# EAGLE design mcu_hw_board (EAGLE 5.11)
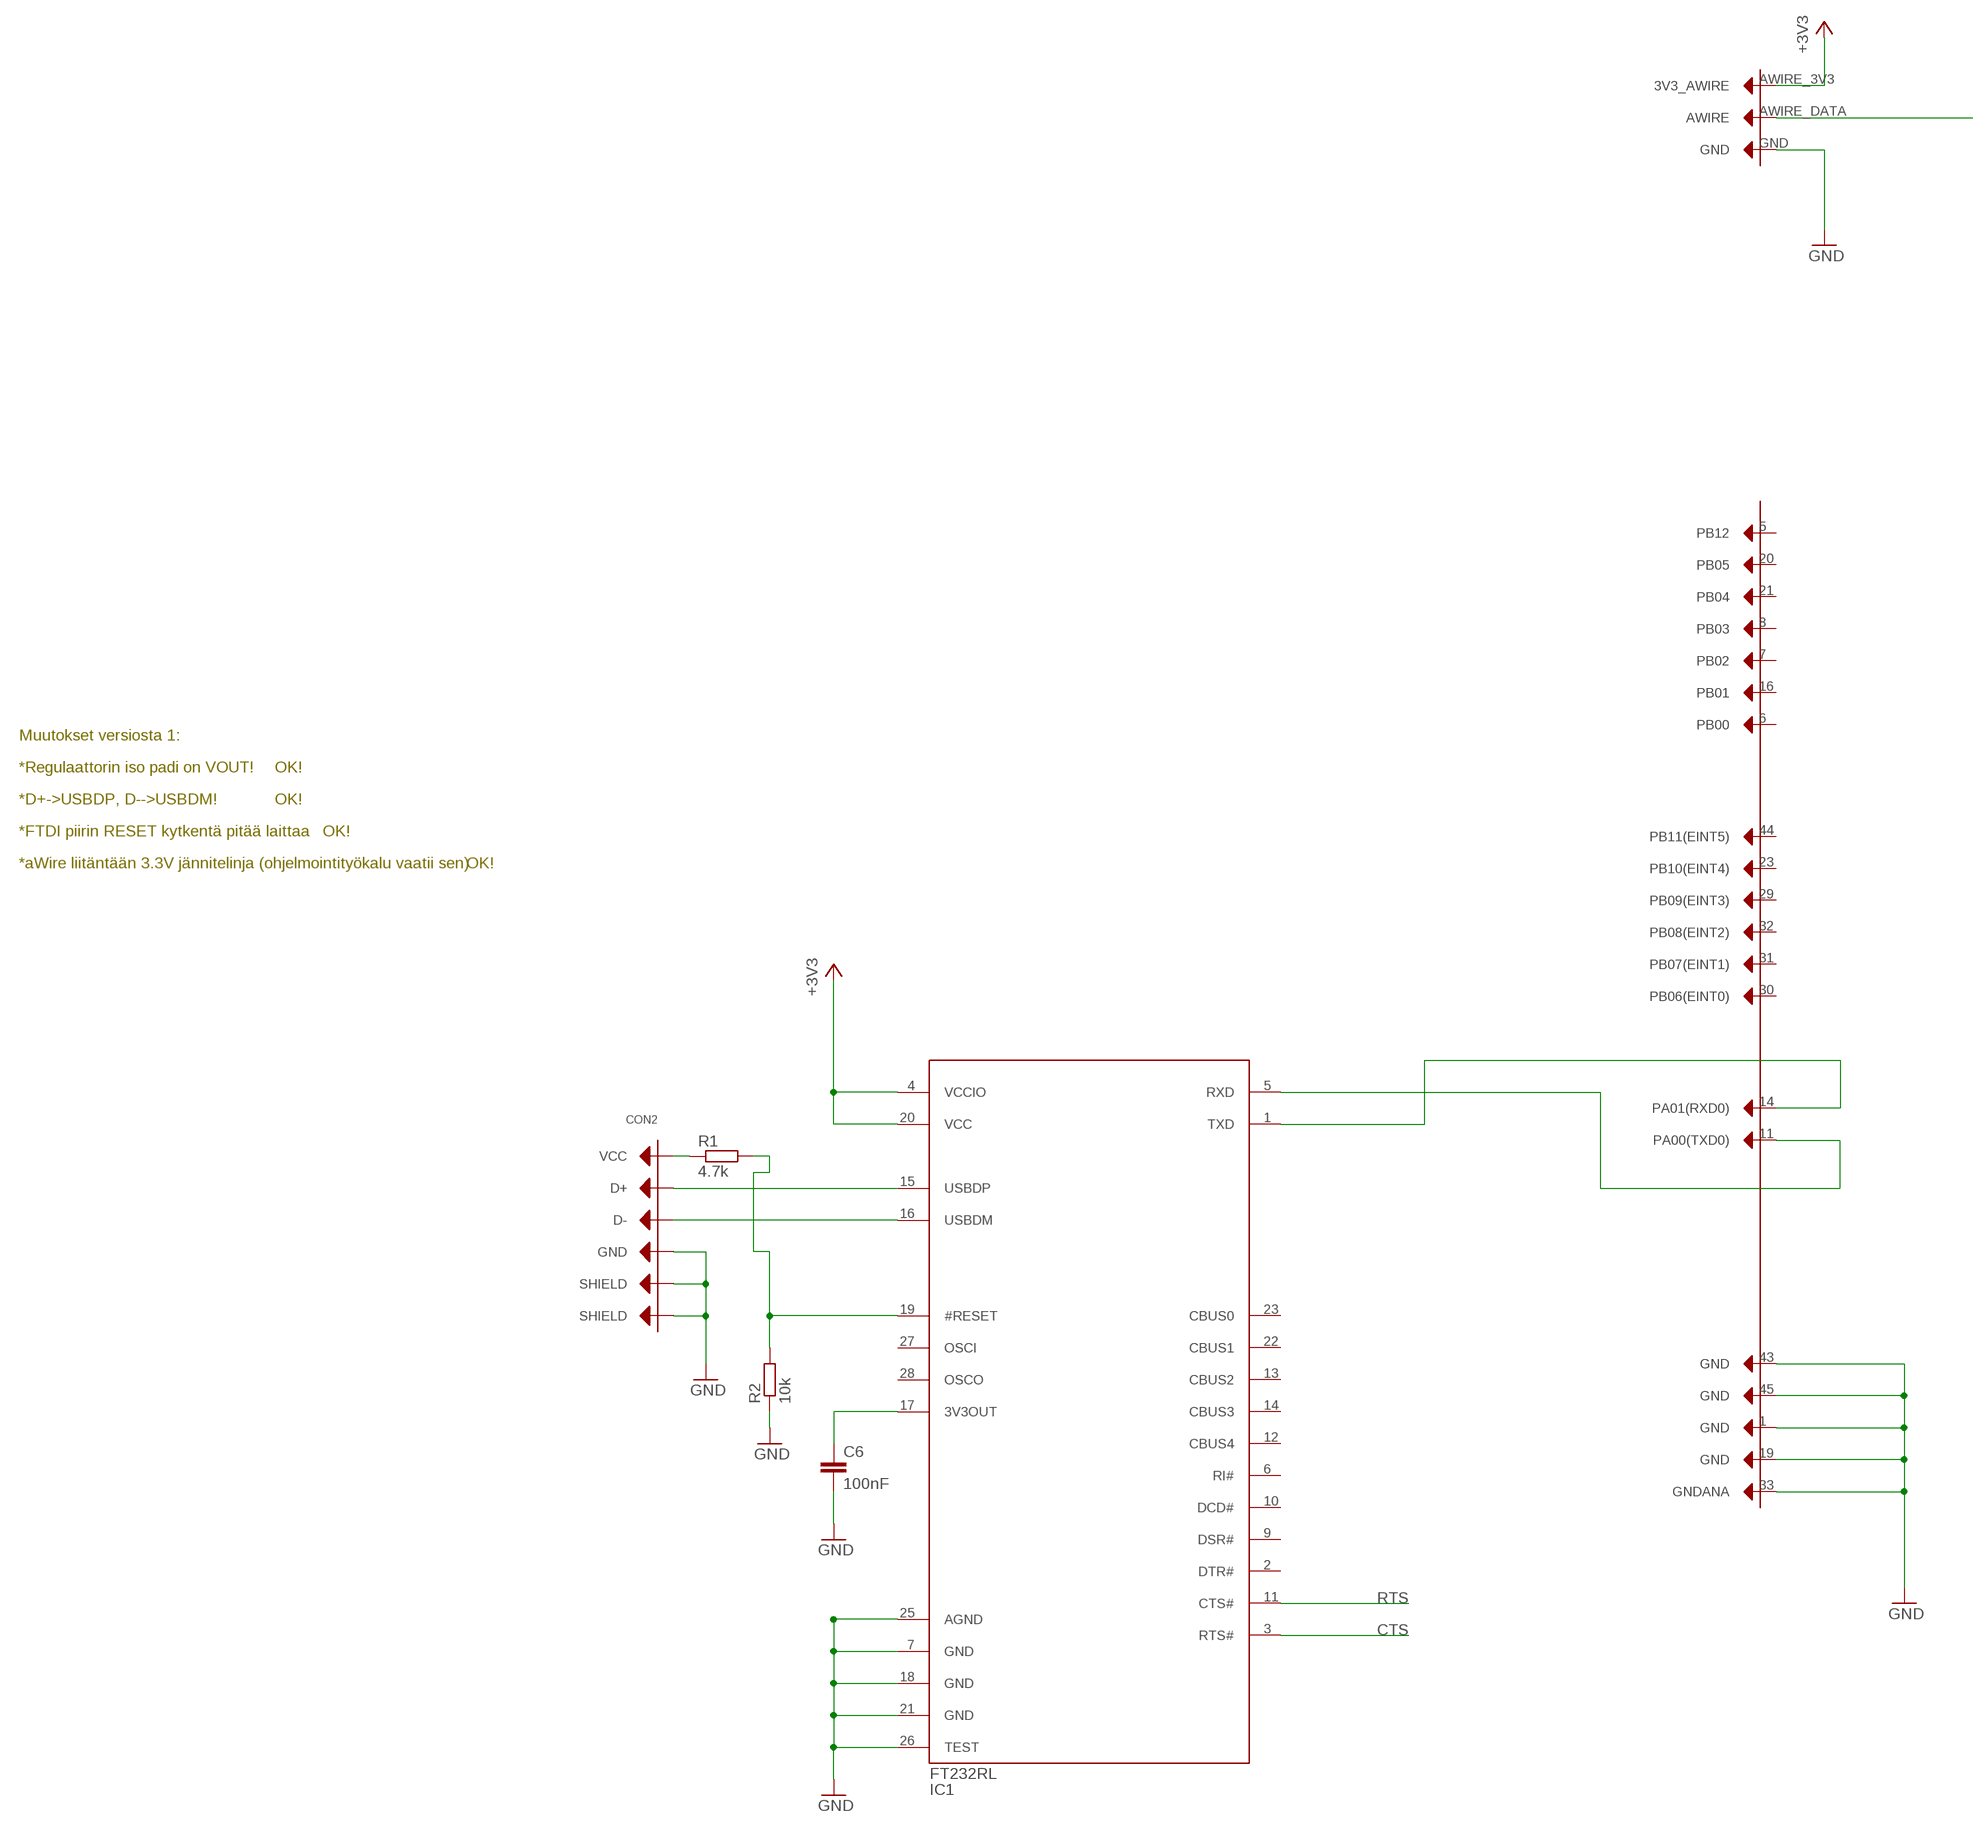
[diagram p0: schematic, sheet 1, part 1 of 2]
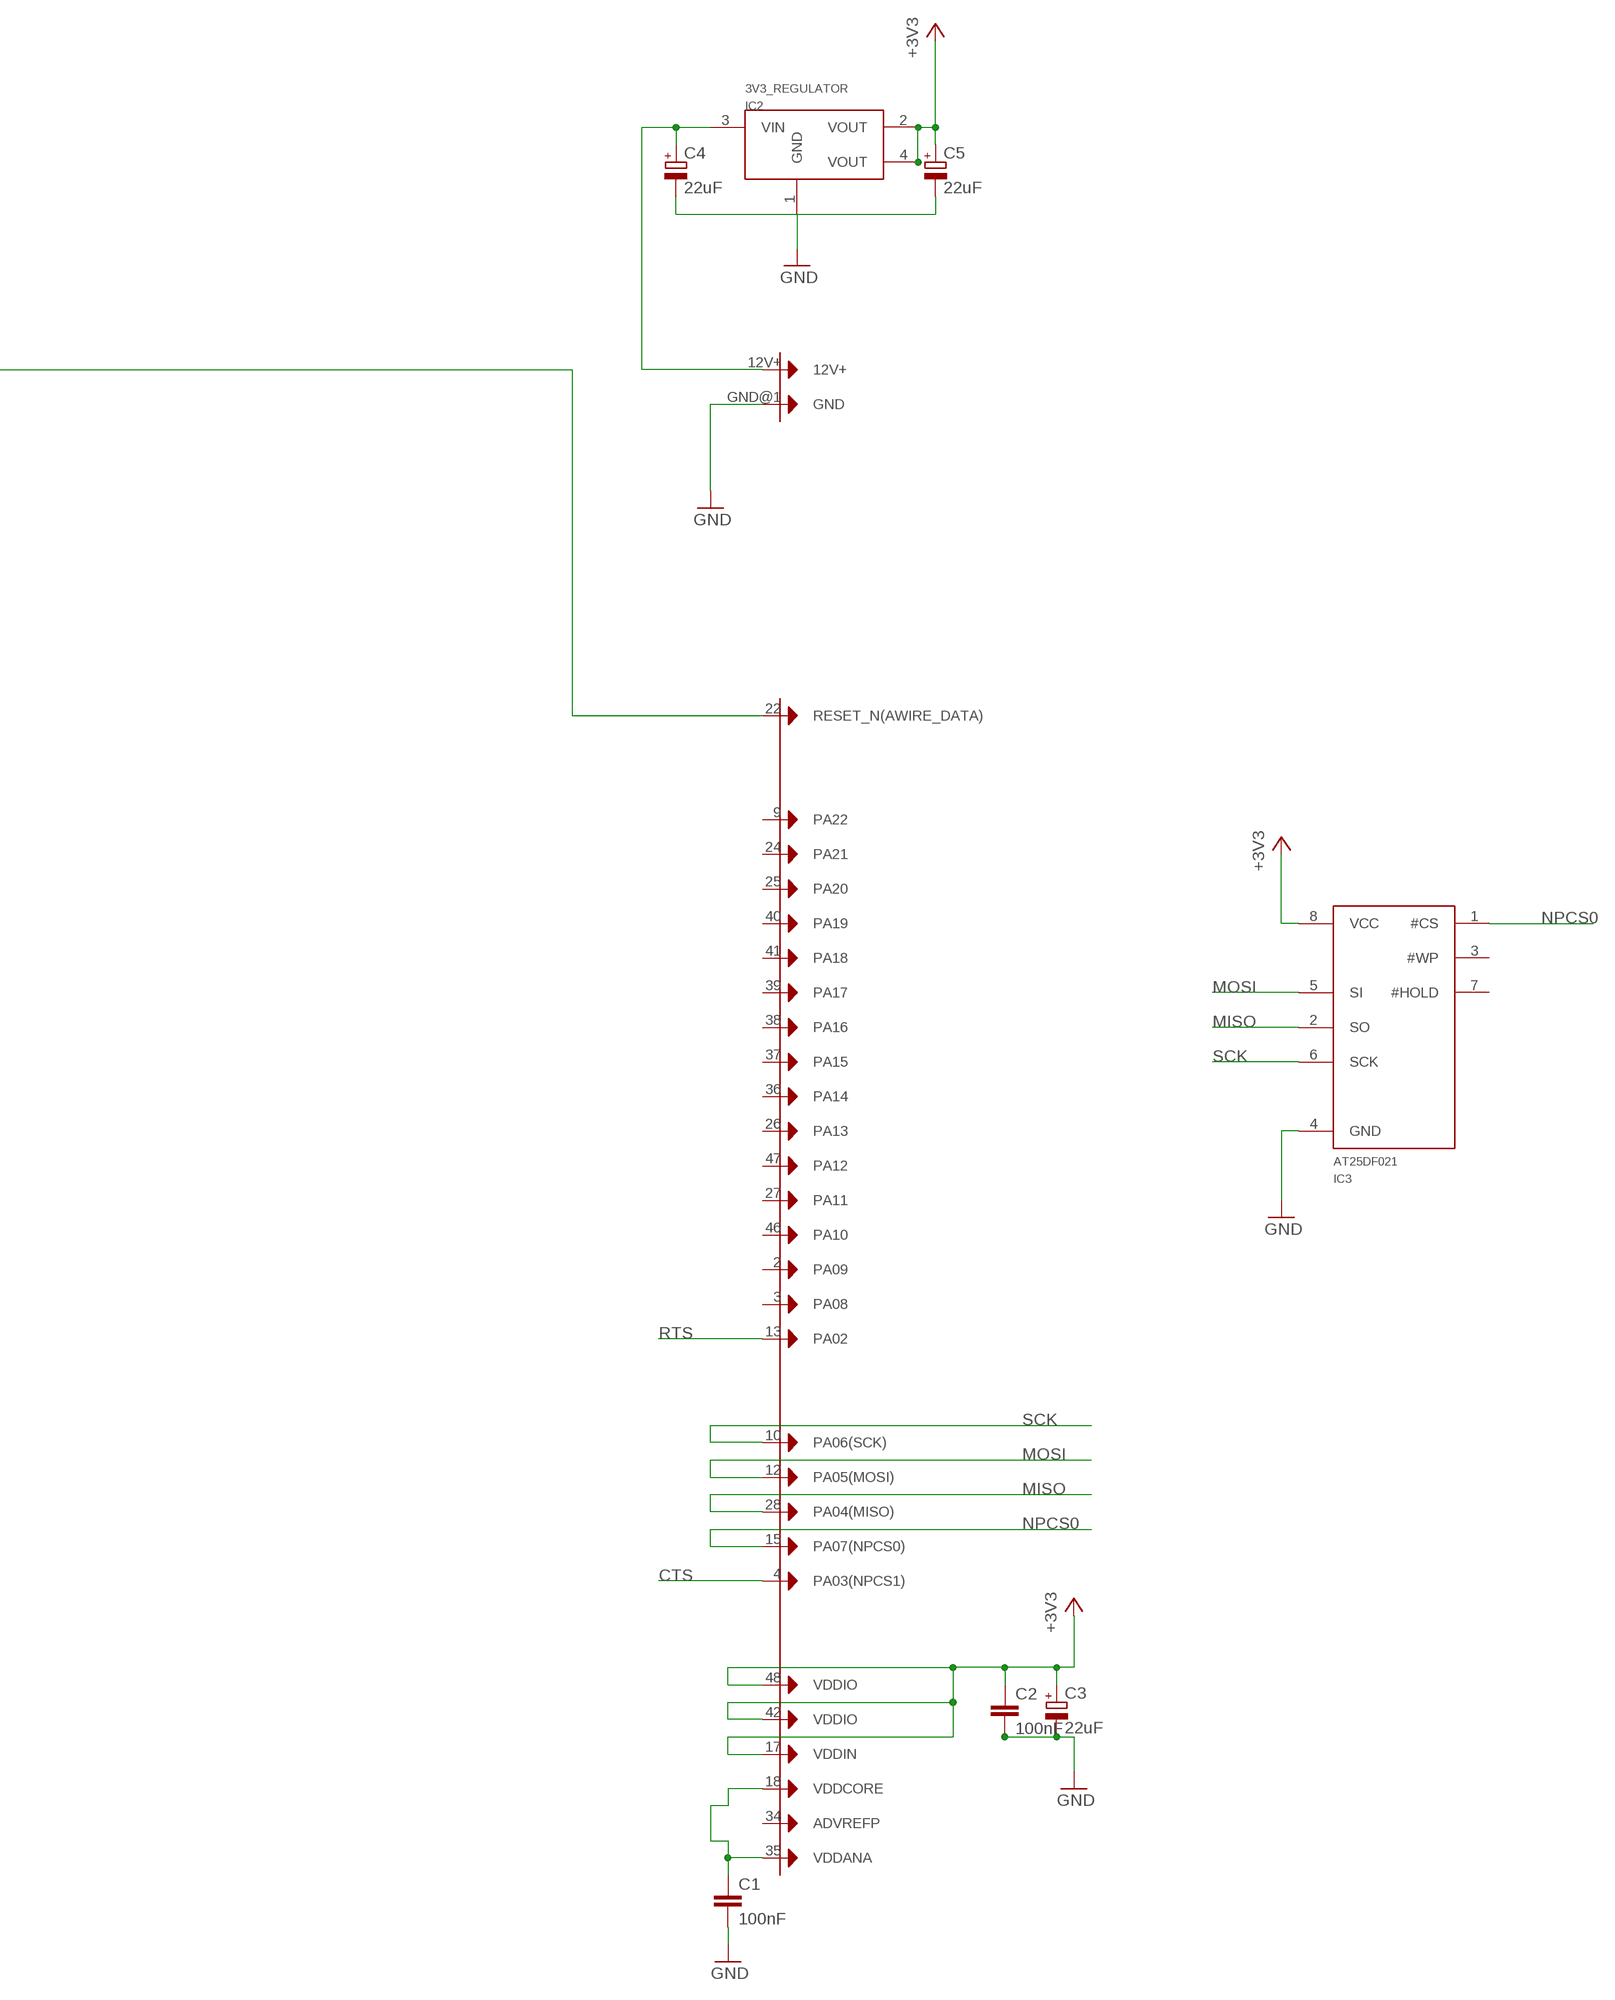
[diagram p1: schematic, sheet 1, part 2 of 2]

## Parts
C1  100nF  C-EU025-025X050  [C025-025X050]
C2  100nF  C-EU025-025X050  [C025-025X050]
C3  22uF  CPOL-EUE2-4  [E2-4]
C4  22uF  CPOL-EUE2-5  [E2-5]
C5  22uF  CPOL-EUE2-5  [E2-5]
C6  100nF  C-EU025-025X050  [C025-025X050]
CON1  IO_BOARD_CONNECTOR  IO_BOARD_CONNECTORUUSI  [AT32UCL_IO_BOARD_CONNECTOR_V2]
CON2  USB-B  [USB-B-THROUGH-HOLE]
IC1  FT232RL  [SSOP28]
IC2  3V3REGULATOR  [SOT223]
IC3  FLASH_AT25DF021  [SO8]
R1  4.7k  R-EU_0207/10  [0207/10]
R2  10k  R-EU_0207/10  [0207/10]

## Nets
+3V3: C2.1 C3.+ C5.+ CON1.17(VDDIN) CON1.42(VDDIO) CON1.48(VDDIO) CON1.AWIRE_3V3(3V3_AWIRE) IC1.4(VCCIO) IC1.20(VCC) IC2.2(VOUT) IC2.4(VOUT) IC3.8(VCC)
CTS: CON1.4(PA03(NPCS1)) IC1.3(RTS#)
GND: C1.2 C2.2 C3.- C4.- C5.- C6.2 CON1.1(GND) CON1.19(GND) CON1.33(GNDANA) CON1.43(GND) CON1.45(GND) CON1.GND CON1.GND@1(GND) CON2.GND CON2.SHIELD CON2.SHIELD@2(SHIELD) IC1.7(GND) IC1.18(GND) IC1.21(GND) IC1.25(AGND) IC1.26(TEST) IC2.1(GND) IC3.4(GND) R2.1
MISO: CON1.28(PA04(MISO)) IC3.2(SO)
MOSI: CON1.12(PA05(MOSI)) IC3.5(SI)
N$14: CON1.14(PA01(RXD0)) IC1.1(TXD)
N$15: CON1.11(PA00(TXD0)) IC1.5(RXD)
N$16: CON1.22(RESET_N(AWIRE_DATA)) CON1.AWIRE_DATA(AWIRE)
N$33: CON2.D+ IC1.15(USBDP)
N$34: CON2.D- IC1.16(USBDM)
N$36: IC1.19(#RESET) R1.2 R2.2
N$38: C4.+ CON1.12V+ IC2.3(VIN)
N$39: CON2.VCC R1.1
N$43: C6.1 IC1.17(3V3OUT)
N$46: C1.1 CON1.18(VDDCORE) CON1.35(VDDANA)
NPCS0: CON1.15(PA07(NPCS0)) IC3.1(#CS)
RTS: CON1.13(PA02) IC1.11(CTS#)
SCK: CON1.10(PA06(SCK)) IC3.6(SCK)
Unconnected: CON1.2(PA09) CON1.3(PA08) CON1.5(PB12) CON1.6(PB00) CON1.7(PB02) CON1.8(PB03) CON1.9(PA22) CON1.16(PB01) CON1.20(PB05) CON1.21(PB04) CON1.23(PB10(EINT4)) CON1.24(PA21) CON1.25(PA20) CON1.26(PA13) CON1.27(PA11) CON1.29(PB09(EINT3)) CON1.30(PB06(EINT0)) CON1.31(PB07(EINT1)) CON1.32(PB08(EINT2)) CON1.34(ADVREFP) CON1.36(PA14) CON1.37(PA15) CON1.38(PA16) CON1.39(PA17) CON1.40(PA19) CON1.41(PA18) CON1.44(PB11(EINT5)) CON1.46(PA10) CON1.47(PA12) IC1.2(DTR#) IC1.6(RI#) IC1.9(DSR#) IC1.10(DCD#) IC1.12(CBUS4) IC1.13(CBUS2) IC1.14(CBUS3) IC1.22(CBUS1) IC1.23(CBUS0) IC1.27(OSCI) IC1.28(OSCO) IC3.3(#WP) IC3.7(#HOLD)

## Notes on the sheet
- Muutokset versiosta 1:
- *Regulaattorin iso padi on VOUT! | OK!
- *D+->USBDP, D-->USBDM! | OK!
- *FTDI piirin RESET kytkentä pitää laittaa | OK!
- *aWire liitäntään 3.3V jännitelinja (ohjelmointityökalu vaatii sen) | OK!

## Library data of the parts
C1 C2 C6 = RC_and_L:C-EU: CAPACITOR, European symbol
C3-C5 = RC_and_L:CPOL-EU: POLARIZED CAPACITOR, European symbol
CON1 = osat:IO_BOARD_CONNECTOR
CON2 = osat:USB-B
IC1 = osat:FT232RL
IC2 = osat:3V3REGULATOR
IC3 = osat:FLASH_AT25DF021
R1 R2 = RC_and_L:R-EU_: RESISTOR, European symbol

## Board
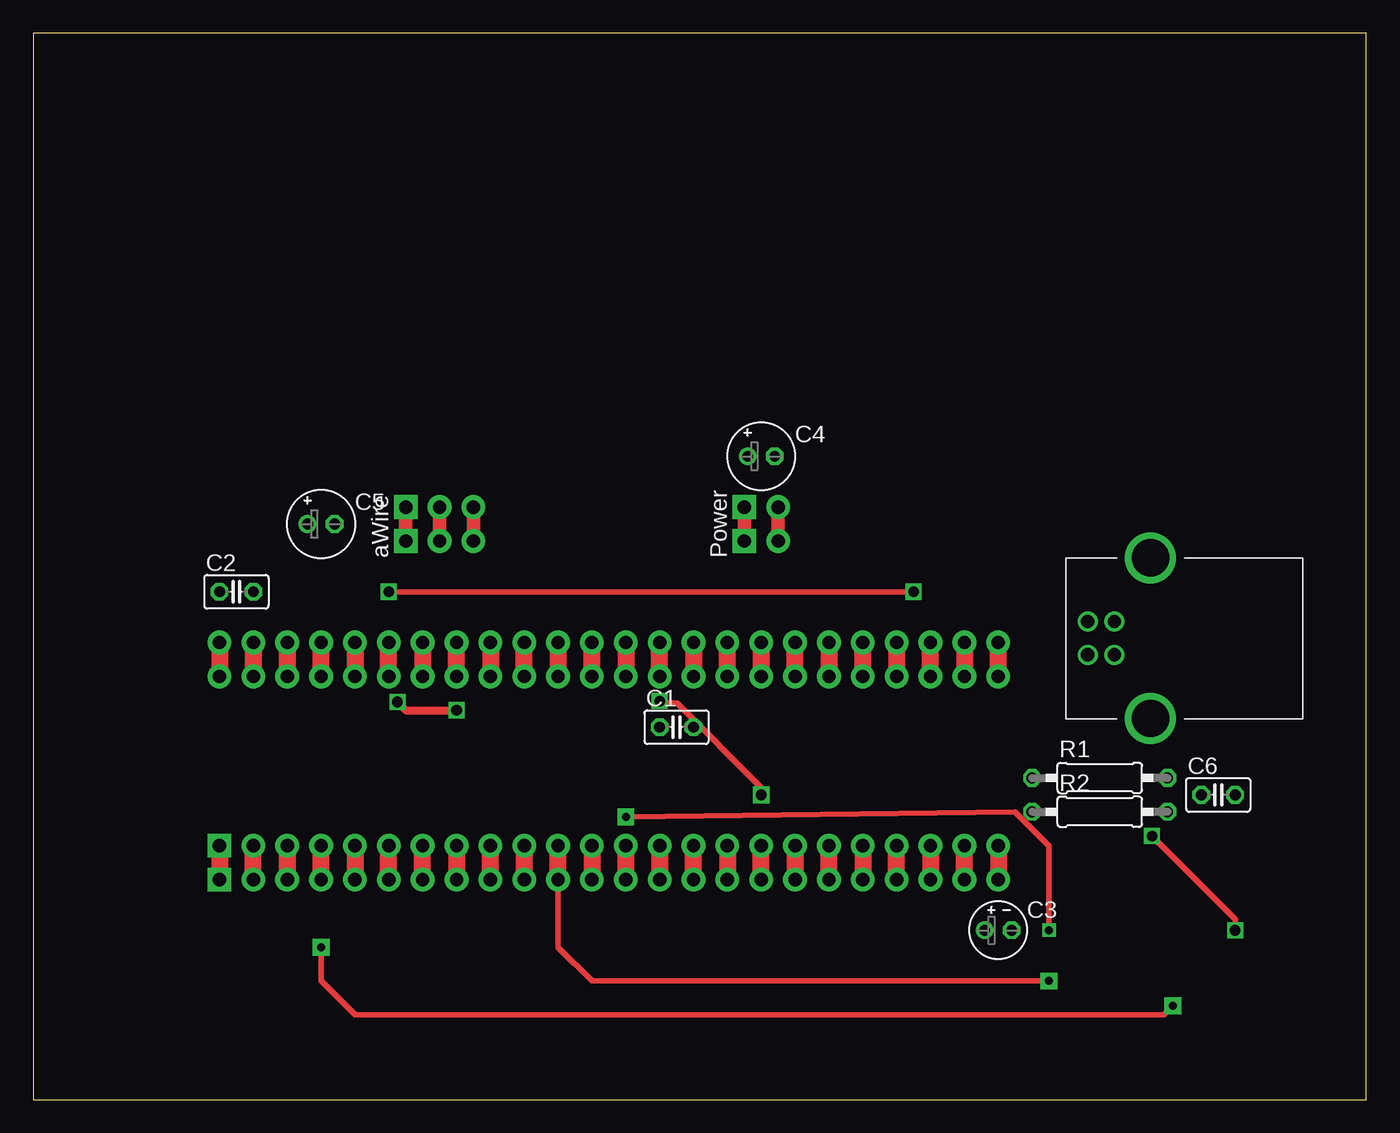
[diagram p2: board, top side]
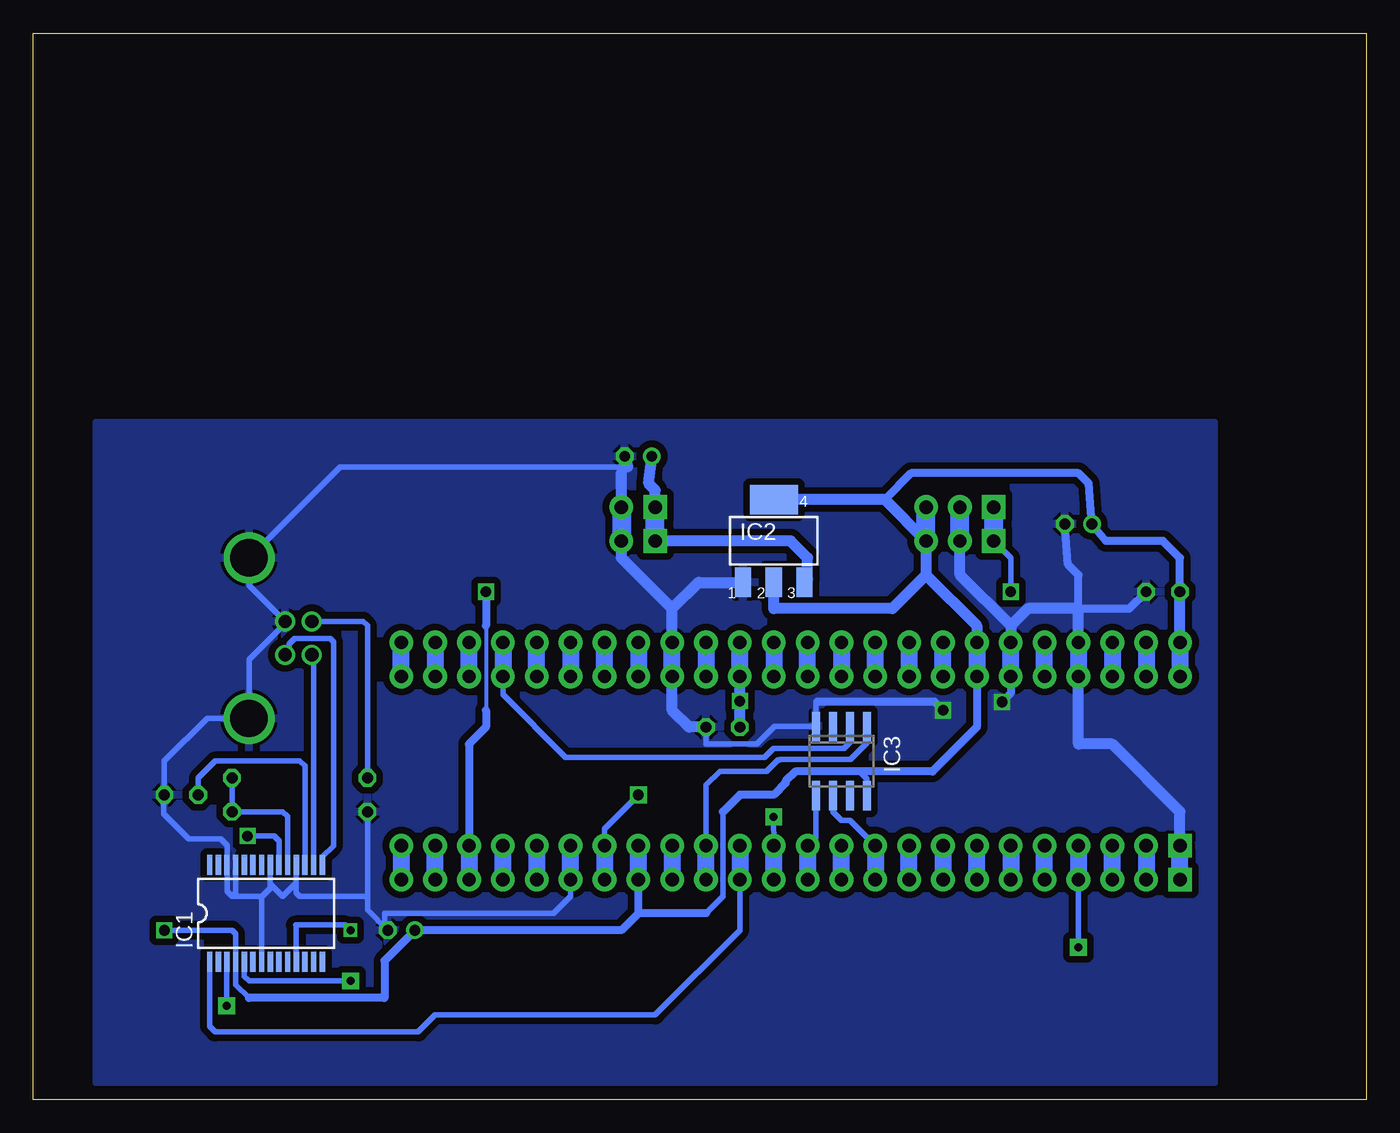
[diagram p3: board, bottom side, seen from below]

Size 100 x 80 mm. Coordinates in mm from the lower left corner, seen from the top.
Outline: 0,0 100,0 100,80 0,80 0,0
Copper layers (1*16): Top 0.035mm / dielectric 1.5mm / Bottom 0.035mm
Design rules "prototyping_home": minimum track width 0.4mm, minimum drill 24mil, track to track 20mil, track to pad 20mil, pad to pad 8mil, via to via 8mil, smd to smd 8mil, copper to edge 40mil, drill to drill 8mil, minimum pad ring 10mil, minimum via ring 8mil, stop-mask expansion 4mil, vias tented up to drill 0mil, thermal gap 10mil

### Footprints (pad centres in the part's own frame; a part is rotated, then mirrored left to right if it is on the bottom)
C025-025X050 = drill 0.813 octagon: 1 -1.27,0; 2 1.27,0
E2-4 = drill 0.813 pad 1.27 round: + -1.016,0 | drill 0.813 pad 1.27 octagon: - 1.016,0
E2-5 = drill 0.813 pad 1.27 round: + -1.016,0 | drill 0.813 pad 1.27 octagon: - 1.016,0
AT32UCL_IO_BOARD_CONNECTOR_V2 = drill 1 pad 1.778 square: 1 -15.24,-19.05; 12V+ 24.13,3.81; AWIRE_DATA -1.27,3.81; NC1 -15.24,-21.59; P$100 -1.27,6.35; P$104 24.13,6.35 | drill 1 pad 1.778 round: 2 -12.7,-19.05; 3 -10.16,-19.05; 4 -7.62,-19.05; 5 -5.08,-19.05; 6 -2.54,-19.05; 7 0,-19.05; 8 2.54,-19.05; 9 5.08,-19.05; 10 7.62,-19.05; 11 10.16,-19.05; 12 12.7,-19.05; 13 15.24,-19.05; 14 17.78,-19.05; 15 20.32,-19.05; 16 22.86,-19.05; 17 25.4,-19.05; 18 27.94,-19.05; 19 30.48,-19.05; 20 33.02,-19.05; 21 35.56,-19.05; 22 38.1,-19.05; 23 40.64,-19.05; 24 43.18,-19.05; 25 43.18,-3.81; 26 40.64,-3.81; 27 38.1,-3.81; 28 35.56,-3.81; 29 33.02,-3.81; 30 30.48,-3.81; 31 27.94,-3.81; 32 25.4,-3.81; 33 22.86,-3.81; 34 20.32,-3.81; 35 17.78,-3.81; 36 15.24,-3.81; 37 12.7,-3.81; 38 10.16,-3.81; 39 7.62,-3.81; 40 5.08,-3.81; 41 2.54,-3.81; 42 0,-3.81; 43 -2.54,-3.81; 44 -5.08,-3.81; 45 -7.62,-3.81; 46 -10.16,-3.81; 47 -12.7,-3.81; 48 -15.24,-3.81; 49 43.18,-6.35; 50 40.64,-6.35; 51 38.1,-6.35; 52 35.56,-6.35; 53 33.02,-6.35; 54 30.48,-6.35; 55 27.94,-6.35; 56 25.4,-6.35; 57 22.86,-6.35; 58 20.32,-6.35; 59 17.78,-6.35; 60 15.24,-6.35; 61 12.7,-6.35; 62 10.16,-6.35; 63 7.62,-6.35; 64 5.08,-6.35; 65 2.54,-6.35; 66 0,-6.35; 67 -2.54,-6.35; 68 -5.08,-6.35; 69 -7.62,-6.35; 70 -10.16,-6.35; 71 -12.7,-6.35; 72 -15.24,-6.35; AWIRE_3V3 3.81,3.81; GND 1.27,3.81; GND@1 26.67,3.81; NC2 -12.7,-21.59; NC3 -10.16,-21.59; NC4 -7.62,-21.59; NC5 -5.08,-21.59; NC6 -2.54,-21.59; NC7 0,-21.59; NC8 2.54,-21.59; NC9 5.08,-21.59; NC10 7.62,-21.59; NC11 10.16,-21.59; NC12 12.7,-21.59; NC13 15.24,-21.59; NC14 17.78,-21.59; NC15 20.32,-21.59; NC16 22.86,-21.59; NC17 25.4,-21.59; NC18 27.94,-21.59; NC19 30.48,-21.59; NC20 33.02,-21.59; NC21 35.56,-21.59; NC22 38.1,-21.59; NC23 40.64,-21.59; NC24 43.18,-21.59; P$1 3.81,6.35; P$99 1.27,6.35; P$103 26.67,6.35
USB-B-THROUGH-HOLE = drill 1 round: D+ 7.27,-2.71; D- 7.27,-4.71; GND 4.77,-2.71; VCC 4.77,-4.71 | drill 2.8 round: SHIELD 0,0; SHIELD@2 12.04,0
SSOP28 = smd 0.4 x 1.5: 1 -4.225,-3.625; 2 -3.575,-3.625; 3 -2.925,-3.625; 4 -2.275,-3.625; 5 -1.625,-3.625; 6 -0.975,-3.625; 7 -0.325,-3.625; 8 0.325,-3.625; 9 0.975,-3.625; 10 1.625,-3.625; 11 2.275,-3.625; 12 2.925,-3.625; 13 3.575,-3.625; 14 4.225,-3.625; 15 4.225,3.625; 16 3.575,3.625; 17 2.925,3.625; 18 2.275,3.625; 19 1.625,3.625; 20 0.975,3.625; 21 0.325,3.625; 22 -0.325,3.625; 23 -0.975,3.625; 24 -1.625,3.625; 25 -2.275,3.625; 26 -2.925,3.625; 27 -3.575,3.625; 28 -4.225,3.625
SOT223 = smd 1.219 x 2.235: 1 -2.311,-3.099; 2 0,-3.099; 3 2.311,-3.099 | smd 3.6 x 2.2: 4 0,3.099
SO8 = smd 0.6 x 2.2: 1 -1.905,-2.6; 2 -0.635,-2.6; 3 0.635,-2.6; 4 1.905,-2.6; 5 1.905,2.6; 6 0.635,2.6; 7 -0.635,2.6; 8 -1.905,2.6
0207/10 = drill 0.813 octagon: 1 -5.08,0; 2 5.08,0

### Placement (x,y rotation side)
C1  48.26,27.94 0 top
C2  15.24,38.1 0 top
C3  72.39,12.7 0 top
C4  54.61,48.26 0 top
C5  21.59,43.18 0 top
C6  88.9,22.86 0 top
CON1  29.21,38.1 0 top
CON2  83.82,40.64 270 top
IC1  82.55,13.97 0 bottom
IC2  44.45,41.91 0 bottom
IC3  39.37,25.4 180 bottom
R1  80.01,24.13 0 top
R2  80.01,21.59 0 top

### Tracks (layer width: path | path; a pad name or v marks a point on that pad's centre or on a via)
+3V3  (via drill 0.8)
  Top 0.406: v90.17,12.7 90.17,13.53 v83.93,19.77
  Bottom 0.406: IC3.8 37.47,24.07 38.01,24.61 42.84,24.61 | 43.56,23.89 43.56,23.75 | 48.26,21.59 48.26,15.24 49.53,13.97 | v90.17,12.7 85.09,12.7 84.83,12.44 IC1.4 84.83,8.62 83.82,7.62 | IC1.20 81.58,19.4 81.95,19.77 v83.93,19.77
  Bottom 0.61: 43.56,23.89 42.84,24.61 32.54,24.61 29.21,27.94 CON1.42 | 43.56,23.75 44.45,22.86 46.99,22.86 48.26,21.59 | 49.53,13.97 54.61,13.97 | 54.61,13.97 CON1.17 | 54.61,13.97 55.88,12.7 C3.+ 73.66,10.41 73.66,7.62 83.82,7.62 | 36.12,45.01 34.14,46.99 21.59,46.99 20.82,46.22 C5.+ 19.55,41.91 15.24,41.91 13.97,40.64 C2.1
  Bottom 0.813: 33.02,39.37 CON1.AWIRE_3V3 36.12,45.01 IC2.4 | CON1.42 29.21,35.56 33.02,39.37 | IC2.2 44.45,36.83 35.56,36.83 33.02,39.37 | CON1.48 C2.1
CTS  (via drill 0.6 pad 1.27)
  Top 0.406: v21.59,11.43 21.59,8.89 24.13,6.35 84.81,6.35 v85.49,7.03
  Bottom 0.406: v21.59,11.43 CON1.4 | v85.49,7.03 85.49,10.33 IC1.3
GND  (via drill 0.8)
  Top 0.61: v31.75,29.21 27.94,29.21 v27.32,29.83
  Bottom 0.406: C1.2 49.53,26.67 45.72,26.67 44.39,28 IC3.4 41.27,29.73 41.18,29.83 | 82.88,15.2 IC1.7 | 82.88,15.2 82.22,15.85 IC1.21 82.22,16.18 81.28,15.24 80.28,16.25 IC1.18 80.28,15.51 80.01,15.24 74.93,15.24 | 85.09,15.24 85.47,15.62 IC1.26 85.47,19.09 85.94,19.56 88.35,19.56 90.22,21.43 90.22,22.81 C6.2 90.17,25.4 86.97,28.6 CON2.SHIELD@2 83.82,33.02 81.11,35.73 CON2.GND 83.82,38.58 CON2.SHIELD 76.99,47.47 55.4,47.47 | 85.09,15.24 82.92,15.24 82.88,15.2 | IC1.25 84.83,15.51 85.09,15.24 | 74.93,15.24 R2.1 | 74.93,15.24 74.93,14.22 C3.- 73.66,12.95 73.66,13.97 60.96,13.97 59.69,15.24 CON1.19 | 55.88,46.99 55.88,47.78 C4.-
  Bottom 0.61: C2.2 17.78,36.83 21.59,36.83 21.59,39.37 22.38,40.16 C5.- | CON1.43 26.67,30.48 v27.32,29.83 | 41.18,29.83 32.37,29.83 v31.75,29.21
  Bottom 0.813: 26.67,35.56 30.48,39.37 CON1.GND | IC2.1 50.09,38.81 52.07,36.83 | 52.07,36.83 CON1.33 52.07,29.21 50.8,27.94 C1.2 | 52.07,36.83 55.88,40.64 CON1.GND@1 55.88,46.99 | C4.- 55.4,47.47 | 26.67,35.56 CON1.43 | 26.67,35.56 25.4,36.83 21.59,36.83 CON1.45 21.59,26.67 19.05,26.67 13.97,21.59 CON1.1
  pour Bottom: 11.43,50.8 11.43,1.27 95.25,1.27 95.25,50.8
MISO
  Bottom 0.406: IC3.2 38.73,26.8 39.2,26.34 44.45,26.34 45.13,25.66 60.05,25.66 64.77,30.38 CON1.28
MOSI
  Bottom 0.406: IC3.5 41.27,19.68 CON1.12
N$14
  Bottom 0.406: CON1.14 46.99,12.7 53.34,6.35 69.85,6.35 71.12,5.08 86.36,5.08 86.78,5.5 IC1.1
N$15  (via drill 0.6 pad 1.27)
  Top 0.406: v76.2,8.89 41.91,8.89 39.37,11.43 CON1.11
  Bottom 0.406: IC1.5 84.17,9.24 83.82,8.89 v76.2,8.89
N$16  (via drill 0.8)
  Top 0.406: v26.67,38.1 v66.04,38.1
  Bottom 0.305: 66.04,35.56 66.04,29.21
  Bottom 0.406: v26.67,38.1 26.67,40.64 CON1.AWIRE_DATA
  Bottom 0.61: v66.04,38.1 66.04,35.56 | 66.04,29.21 66.04,27.94 67.31,26.67 CON1.22
N$33
  Bottom 0.406: IC1.15 78.33,18.2 77.47,19.05 77.47,34.33 77.72,34.58 80.39,34.58 80.8,34.17 80.8,33.68 CON2.D+
N$34
  Bottom 0.406: IC1.16 78.97,33.23 CON2.D-
N$36
  Bottom 0.406: IC1.19 80.92,21.23 81.28,21.59 R2.2 R1.2
N$38
  Bottom 0.813: IC2.3 41.91,39.04 41.91,40.64 43.18,41.91 CON1.12V+ 53.34,45.72 53.84,46.22 C4.+
N$39
  Bottom 0.406: CON2.VCC 75.24,35.87 74.93,35.56 R1.1
N$43
  Bottom 0.406: C6.1 87.63,24.13 86.36,25.4 80.01,25.4 79.62,25.02 IC1.17
N$46  (via drill 0.8, 0.8 pad 1.27)
  Top 0.406: v54.61,22.86 54.61,23.43 48.28,29.75 47.13,29.75 v46.99,29.89
  Bottom 0.406: CON1.18 57.15,20.32 v54.61,22.86
  Bottom 0.813: C1.1 v46.99,29.89 CON1.35
NPCS0
  Bottom 0.406: IC3.1 37.47,26.75 38.69,25.52 43.99,25.52 44.04,25.47 44.13,25.47 44.99,24.61 48.5,24.61 49.52,23.59 49.52,19.06 CON1.15
RTS  (via drill 0.6, 0.6 pad 1.27)
  Top 0.406: v76.2,12.7 76.2,19.05 73.66,21.59 v44.45,21.2
  Bottom 0.406: IC1.11 80.28,13.05 80.33,13.11 76.61,13.11 v76.2,12.7 | CON1.13 v44.45,21.2
SCK
  Bottom 0.406: IC3.6 40.01,21.59 39.37,20.95 38.73,20.95 CON1.10